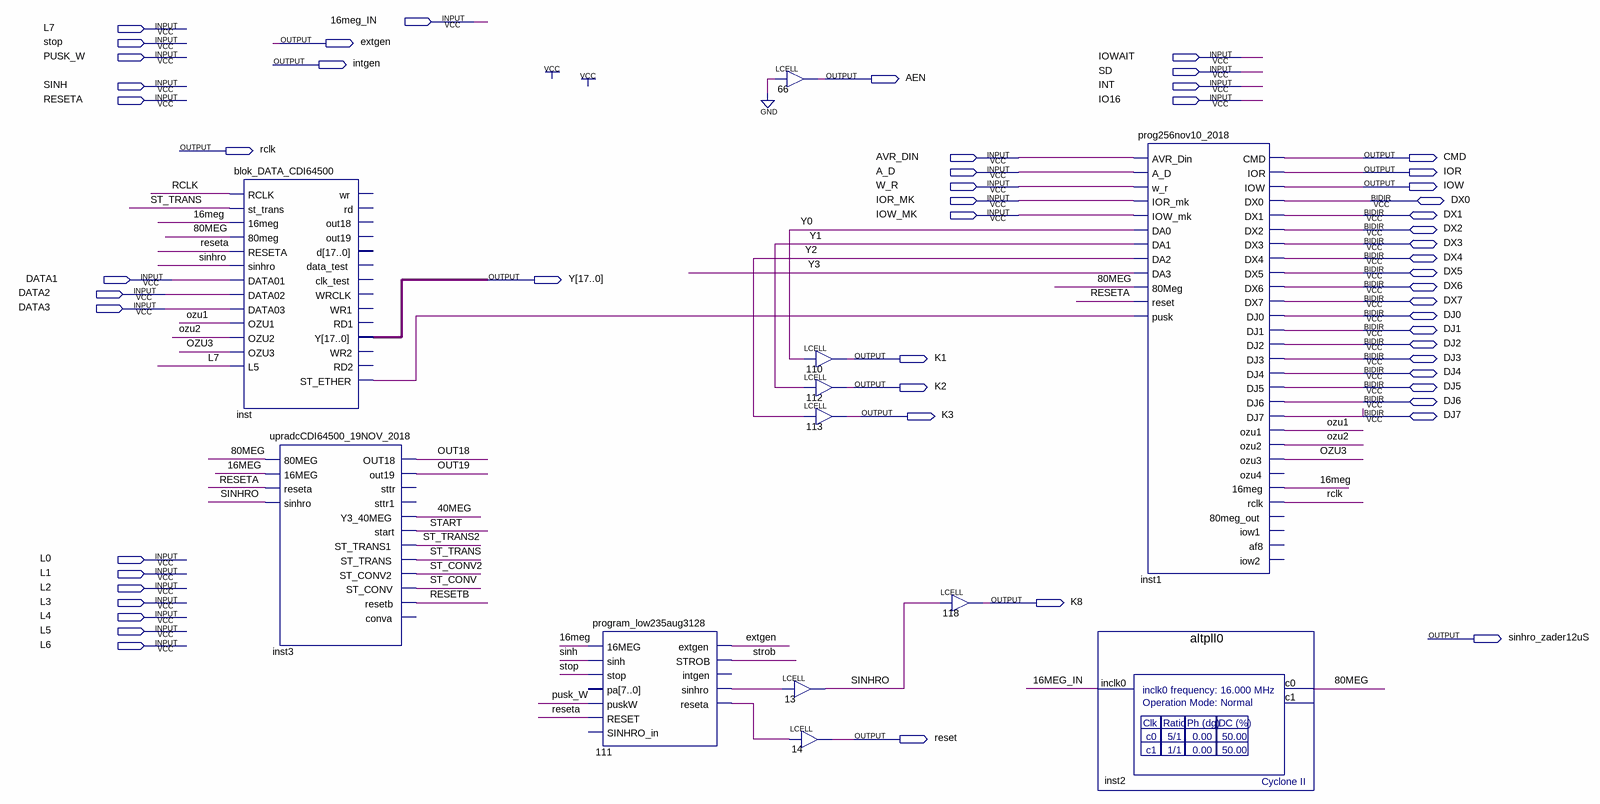
[diagram p0: schematic sheet]
// Quartus schematic program2_CU_2018.bdf as structural Verilog: 12 symbols, 55 pins
module program2_CU_2018 (
  input  \16meg_IN ,
  input  L7,
  input  stop,
  input  PUSK_W,
  input  IOWAIT,
  input  SD,
  input  SINH,
  input  INT,
  input  RESETA,
  input  IO16,
  input  AVR_DIN,
  input  A_D,
  input  W_R,
  input  IOR_MK,
  input  IOW_MK,
  input  DATA1,
  input  DATA2,
  input  DATA3,
  input  L0,
  input  L1,
  input  L2,
  input  L3,
  input  L4,
  input  L5,
  input  L6,
  inout  DX0,
  inout  DX1,
  inout  DX2,
  inout  DX3,
  inout  DX4,
  inout  DX5,
  inout  DX6,
  inout  DX7,
  inout  DJ0,
  inout  DJ1,
  inout  DJ2,
  inout  DJ3,
  inout  DJ4,
  inout  DJ5,
  inout  DJ6,
  inout  DJ7,
  output extgen,
  output intgen,
  output AEN,
  output rclk,
  output CMD,
  output IOR,
  output IOW,
  output [17:0] Y,
  output K1,
  output K2,
  output K3,
  output K8,
  output sinhro_zader12uS,
  output reset
);

  wire \16meg , \40MEG , \80MEG , inst_st_ether, n111_reseta, n111_sinhro, OUT18, OUT19, ozu1, ozu2, OZU3,
       RESETB, SINHRO, ST_CONV, ST_CONV2, ST_TRANS, ST_TRANS2, START, strob;

  blok_DATA_CDI64500 inst (
    .RCLK(rclk), .st_trans(ST_TRANS), .\16meg (\16meg ), .\80meg (\80MEG ), .RESETA(RESETA), .sinhro(SINHRO),
    .DATA01(DATA1), .DATA02(DATA2), .DATA03(DATA3), .OZU1(ozu1), .OZU2(ozu2), .OZU3(OZU3), .L5(L7), .Y(Y),
    .ST_ETHER(inst_st_ether));  // open: wr, rd, out18, out19, d, data_test, clk_test, WRCLK, WR1, RD1, WR2, RD2
  upradcCDI64500_19NOV_2018 inst3 (
    .\80MEG (\80MEG ), .\16MEG (\16meg ), .reseta(RESETA), .sinhro(SINHRO), .OUT18(OUT18), .out19(OUT19),
    .Y3_40MEG(\40MEG ), .start(START), .ST_TRANS1(ST_TRANS2), .ST_TRANS(ST_TRANS), .ST_CONV2(ST_CONV2),
    .ST_CONV(ST_CONV), .resetb(RESETB));  // open: sttr, sttr1, conva
  program_low235aug3128 u_111 (
    .\16MEG (\16meg ), .sinh(SINH), .stop(stop), .puskW(PUSK_W), .RESET(RESETA), .extgen(extgen),
    .STROB(strob), .sinhro(n111_sinhro), .reseta(n111_reseta));  // open: pa, SINHRO_in, intgen
  LCELL u_66 (.IN(1'b0), .OUT(AEN));
  LCELL u_110 (.IN(Y[0]), .OUT(K1));
  LCELL u_112 (.IN(Y[1]), .OUT(K2));
  LCELL u_113 (.IN(Y[2]), .OUT(K3));
  LCELL u_13 (.IN(n111_sinhro), .OUT(SINHRO));
  LCELL u_14 (.IN(n111_reseta), .OUT(reset));
  LCELL u_118 (.IN(SINHRO), .OUT(K8));
  altpll0 inst2 (.inclk0(\16meg_IN ), .c0(\80MEG ));  // open: c1
  prog256nov10_2018 inst1 (
    .AVR_Din(AVR_DIN), .A_D(A_D), .w_r(W_R), .IOR_mk(IOR_MK), .IOW_mk(IOW_MK), .DA0(Y[0]), .DA1(Y[1]),
    .DA2(Y[2]), .DA3(Y[3]), .\80Meg (\80MEG ), .reset(RESETA), .pusk(inst_st_ether), .CMD(CMD), .IOR(IOR),
    .IOW(IOW), .ozu1(ozu1), .ozu2(ozu2), .ozu3(OZU3), .\16meg (\16meg ), .rclk(rclk), .DX0(DX0), .DX1(DX1),
    .DX2(DX2), .DX3(DX3), .DX4(DX4), .DX5(DX5), .DX6(DX6), .DX7(DX7), .DJ0(DJ0), .DJ1(DJ1), .DJ2(DJ2),
    .DJ3(DJ3), .DJ4(DJ4), .DJ5(DJ5), .DJ6(DJ6), .DJ7(DJ7));  // open: ozu4, 80meg_out, iow1, af8, iow2
endmodule
